# EasyEDA Pro project SAM-2.eprj, board sam_layout
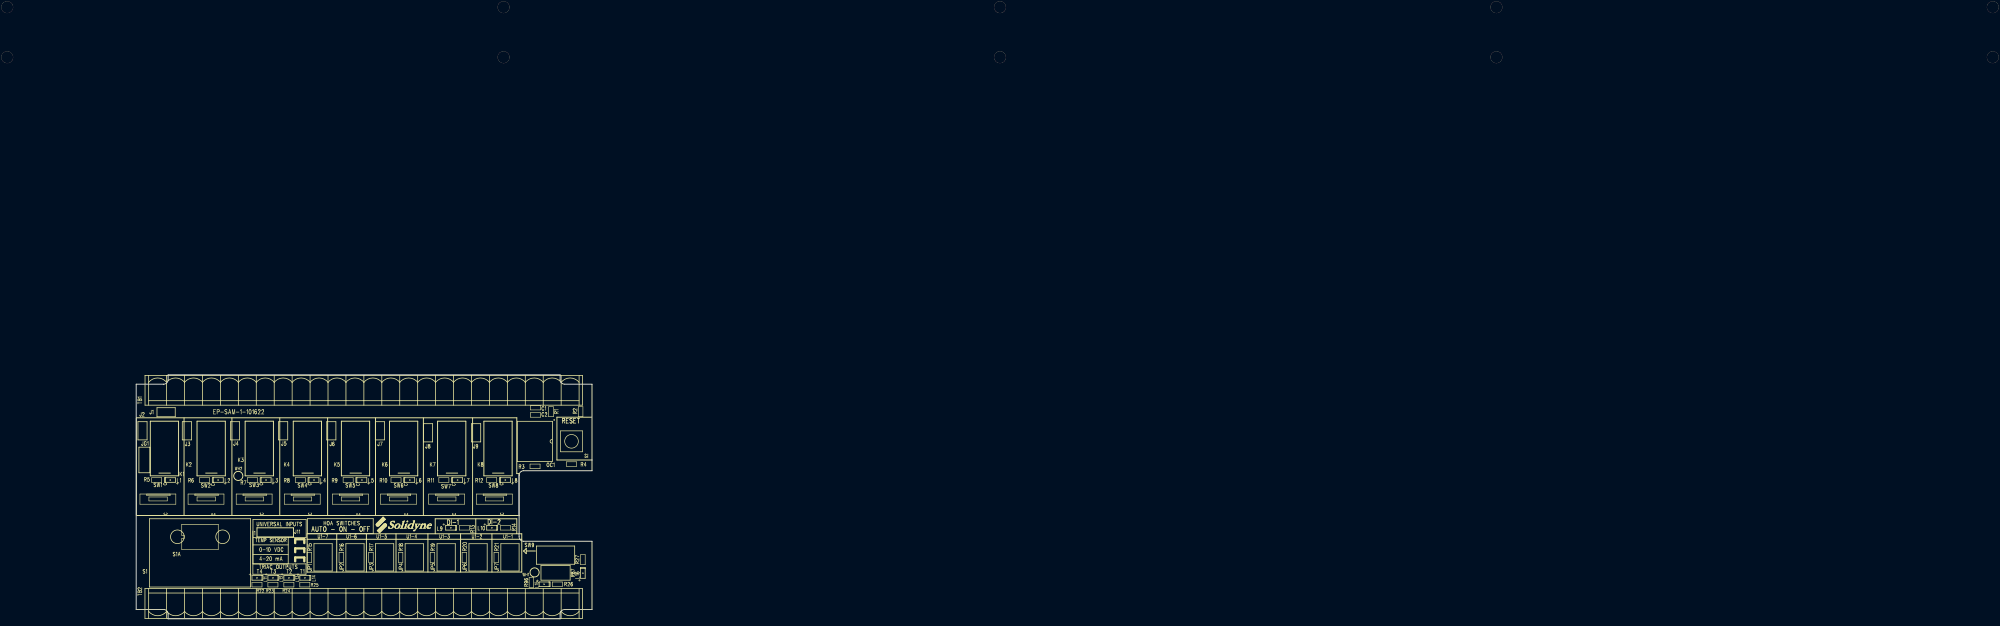
[diagram p24: board, top side]
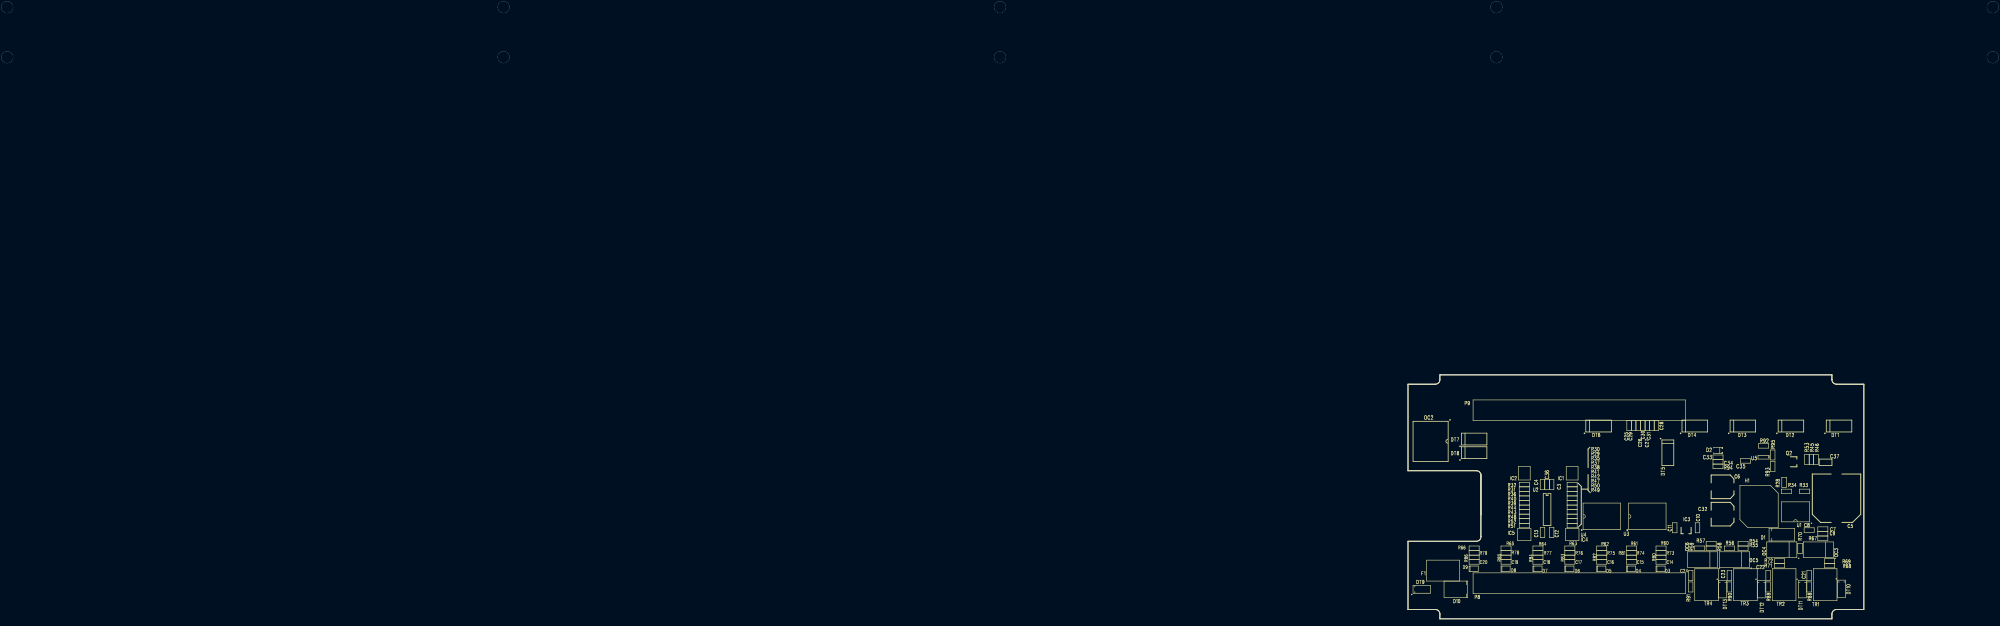
[diagram p25: board, bottom side, seen from below]

Outline 127 x 68.07 mm; copper layers: Top Layer, Bottom Layer. Coordinates in mm from the lower left corner of the outline.
Outline path: 106.68,28.83 106.68,40.51 ; 0,65.47 0,2.6 7.62,2.6 arc(8.52,2.23) 8.89,1.33 8.89,0 118.11,0 118.11,1.33 arc(118.48,2.23) 119.38,2.6 127,2.6 127,21.64 107.95,21.64 arc(107.05,22.01) 106.68,22.91 106.68,40.05 arc(107.05,40.95) 107.95,41.32 127,41.32 127,65.47 119.38,65.47 arc(118.48,65.84) 118.11,66.74 118.11,68.07 8.89,68.07 8.89,66.74 arc(8.52,65.84) 7.62,65.47 0,65.47
Stack: Top Layer 0.035mm / Dielectric1 1.51mm FR4 er 4.5 / Bottom Layer 0.035mm

## Design rules (mm)
spacing safeClearance (default): track to track 0.152, other pairs 0.152 to 0.3
track width trackWidth (default): min 0.127, default 0.254, max 2.54
differential pair differentialPair (default): width min 0.127, default 0.254, max 2.54; gap min 0.152, default 0.152
via viaSize (default): diameter min 0.5, default 0.61, max 10; hole min 0.3, default 0.305, max 6

## Placement (name value [footprint] x y rotation side)

## Nets

## Via types
v1: diameter 3.302, hole 3.302, Top Layer to Bottom Layer, 10 vias

## Routing (per net, layer and track width the routed paths; a pad name or vN(x,y) marks a point on that pad's centre or on a via; arc(x,y) is an arc through that point)
(no net):
  vias: v1(-35.94,170.67) v1(-35.94,156.7) v1(102.36,170.67) v1(102.36,156.7) v1(240.67,170.67) v1(240.67,156.7) v1(378.97,170.67) v1(378.97,156.7) v1(517.27,170.67) v1(517.27,156.7)
